# EAGLE design THC-schematic (EAGLE 6.4)
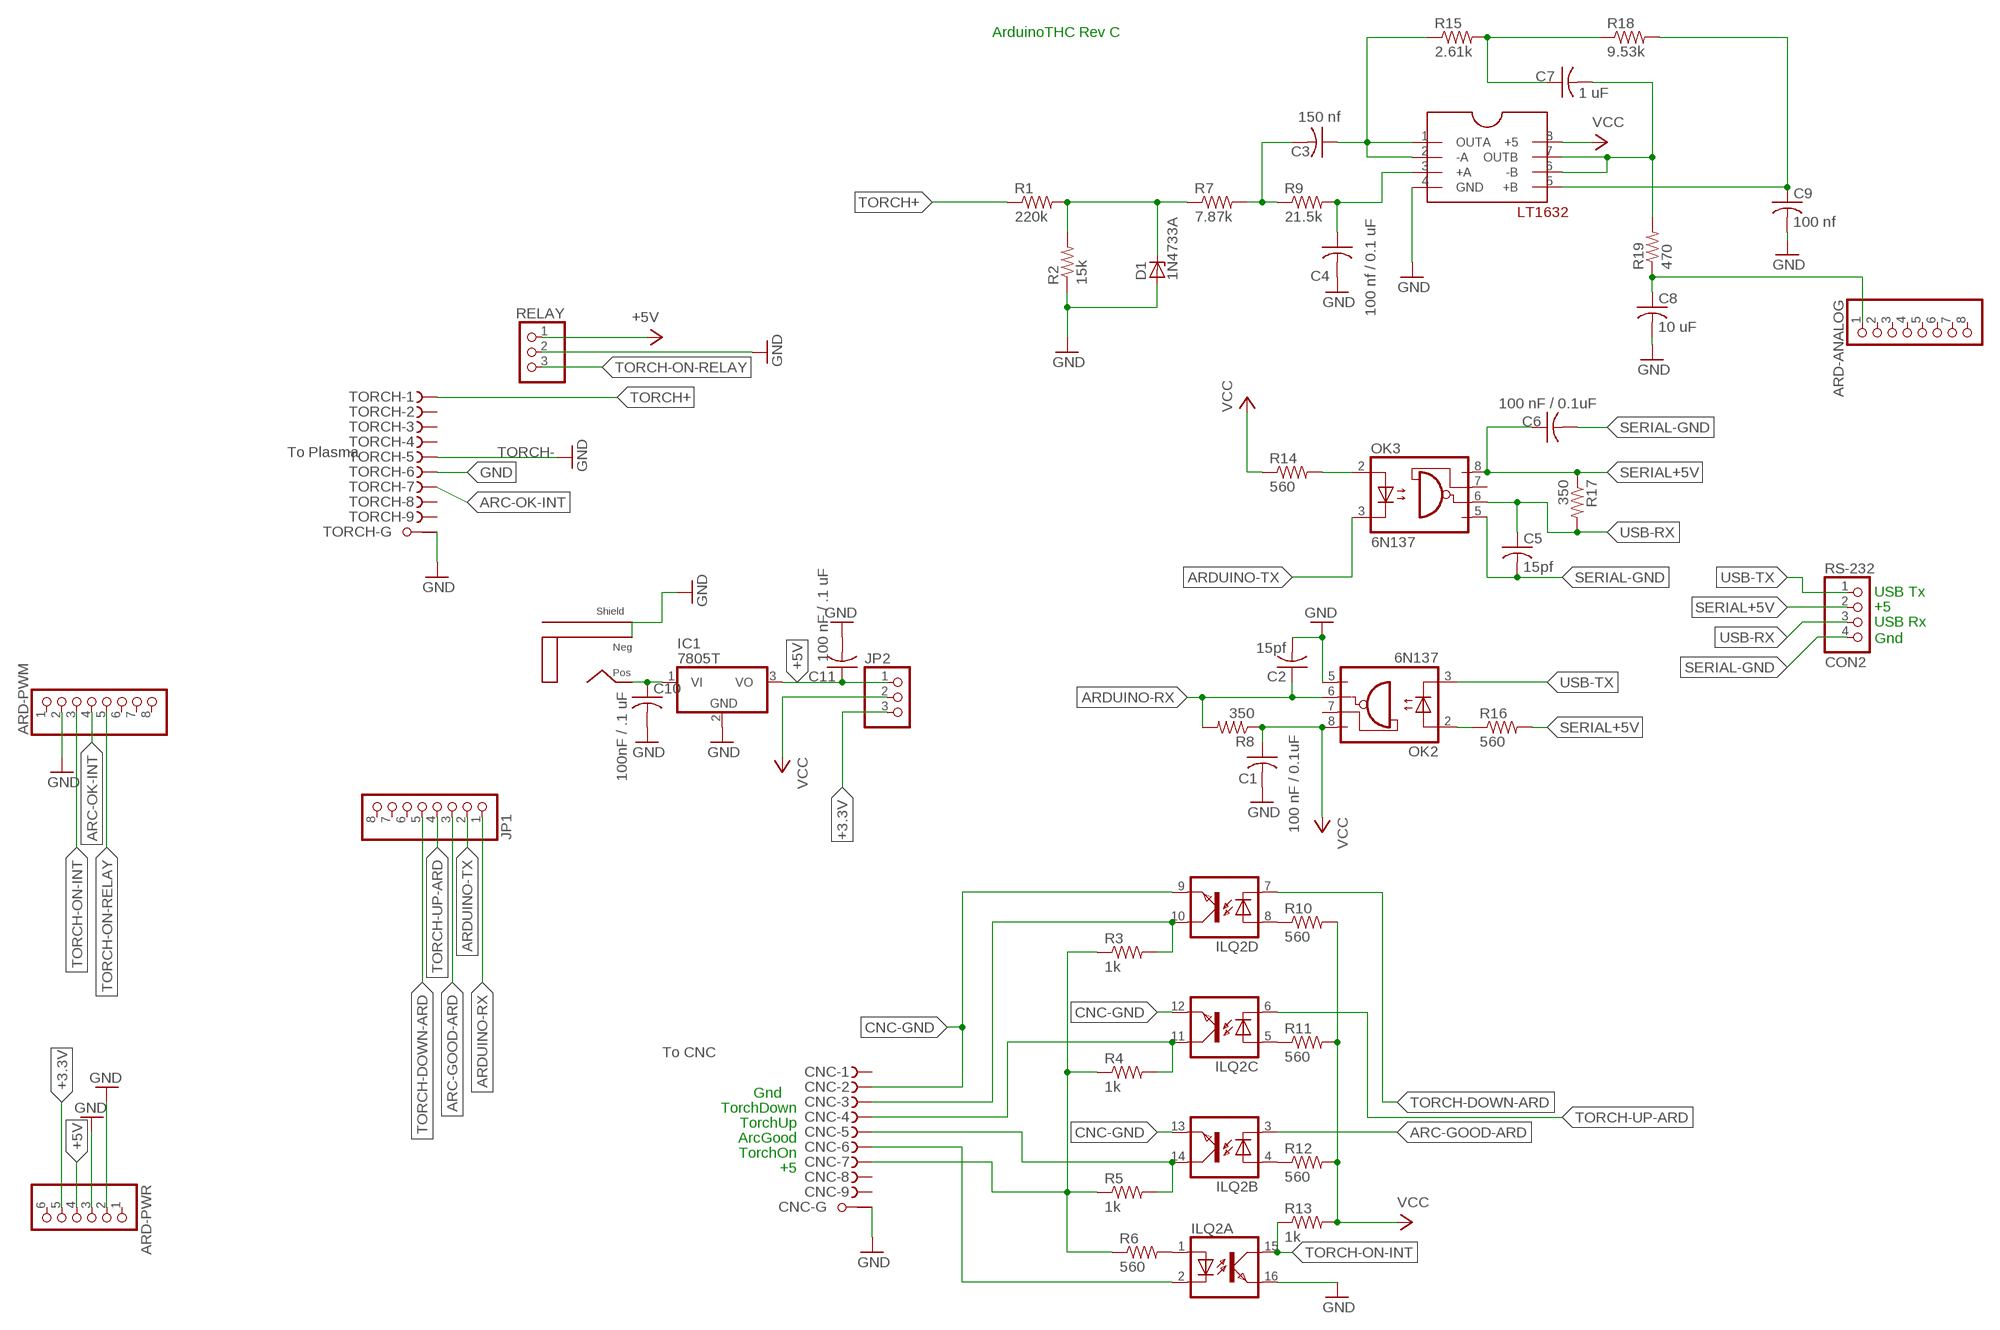
[diagram p0: schematic, sheet 1]

## Parts
ARD-ANALOG  PINHD-1X8  [1X08]
ARD-PWM  PINHD-1X8  [1X08]
ARD-PWR  PINHD-1X6  [1X06]
C1  100 nF / 0.1uF  C-US025-025X050  [C025-025X050]
C2  15pf  C-US025-025X050  [C025-025X050]
C3  150 nf  C-US025-025X050  [C025-025X050]
C4  100 nf / 0.1 uF  C-US025-025X050  [C025-025X050]
C5  15pf  C-US025-025X050  [C025-025X050]
C6  100 nF / 0.1uF  C-US025-025X050  [C025-025X050]
C7  1 uF  C-US025-025X050  [C025-025X050]
C8  10 uF  C-US025-025X050  [C025-025X050]
C9  100 nf  C-US025-025X050  [C025-025X050]
C10  100nF / .1 uF  C-US025-025X050  [C025-025X050]
C11  100 nF / .1 uF  C-US025-025X050  [C025-025X050]
CNC  F09HPS  [F09HP]
D1  1N4733A  ZPY  [DO41Z10]
IC1  7805T  [TO220H]
ILQ2  ILQ1  [DIL16]
J1  2.1MM-PLUG-PCB-MNT  [2.1MM-PLUG]
JP1  PINHD-1X8  [1X08]
JP2  PINHD-1X3  [1X03]
OK2  6N137  [DIL08]
OK3  6N137  [DIL08]
R1  220k  R-US_0207/7  [0207/7]
R2  15k  R-US_0207/7  [0207/7]
R3  1k  R-US_0207/7  [0207/7]
R4  1k  R-US_0207/7  [0207/7]
R5  1k  R-US_0207/7  [0207/7]
R6  560  R-US_0207/7  [0207/7]
R7  7.87k  R-US_0207/7  [0207/7]
R8  350  R-US_0207/7  [0207/7]
R9  21.5k  R-US_0207/7  [0207/7]
R10  560  R-US_0207/7  [0207/7]
R11  560  R-US_0207/7  [0207/7]
R12  560  R-US_0207/7  [0207/7]
R13  1k  R-US_0207/7  [0207/7]
R14  560  R-US_0207/7  [0207/7]
R15  2.61k  R-US_0207/7  [0207/7]
R16  560  R-US_0207/7  [0207/7]
R17  350  R-US_0207/7  [0207/7]
R18  9.53k  R-US_0207/7  [0207/7]
R19  470  R-US_0207/7  [0207/7]
RELAY  PINHD-1X3  [1X03]
RS-232  CON2  PINHD-1X4  [1X04]
TORCH  F09HPS  [F09HP]
U$1  LT1632  [DIP08]

## Nets
+3.3V: ARD-PWR.5 JP2.3
+5V: ARD-PWR.4 C11.1 IC1.3(VO) JP2.1 RELAY.1
ARC-GOOD-ARD: ILQ2.3(B:C) JP1.3
ARC-OK-INT: ARD-PWM.4 TORCH.7(-7:F)
ARD-ANALOG-IN: ARD-ANALOG.1 C8.1 R19.1
ARDUINO-RX: C2.1 JP1.1 OK2.6(VO) R8.2
ARDUINO-TX: JP1.2 OK3.3(C)
CNC-GND: CNC.2(-2:F) ILQ2.9(D:EMIT) ILQ2.12(C:EMIT) ILQ2.13(B:EMIT)
DIVIDER: D1.C R1.2 R2.2 R7.1
GND: ARD-PWM.2 ARD-PWR.2 ARD-PWR.3 C1.2 C2.2 C4.2 C8.2 C9.2 C10.2 C11.2 CNC.G1(-G:G1) D1.A IC1.2(GND) ILQ2.16(A:EMIT) J1.P$NEG J1.P$SHLD OK2.5(GND) R2.1 RELAY.2 TORCH.5(-5:F) TORCH.6(-6:F) TORCH.G1(-G:G1) U$1.4(GND)
N$1: C10.1 IC1.1(VI) J1.P$POS
N$2: ILQ2.4(B:A) R12.1
N$7: ILQ2.5(C:A) R11.1
N$8: ILQ2.8(D:A) R10.1
N$9: ILQ2.1(A:A) R6.2
N$10: CNC.5(-5:F) ILQ2.14(B:COL) R5.2
N$11: CNC.4(-4:F) ILQ2.11(C:COL) R4.2
N$12: CNC.3(-3:F) ILQ2.10(D:COL) R3.2
N$16: CNC.6(-6:F) ILQ2.2(A:C)
N$22: CNC.7(-7:F) R3.1 R4.1 R5.1 R6.1
N$26: C3.2 R7.2 R9.1
N$27: C4.1 R9.2 U$1.3(+A)
N$29: C3.1 R15.1 U$1.1(OUTA) U$1.2(-A)
N$30: C7.1 R15.2 R18.1
N$31: C9.1 R18.2 U$1.5(+B)
N$32: OK3.2(A) R14.2
N$34: OK2.2(A) R16.1
SERIAL+5V: C6.1 OK3.8(VCC) R16.2 R17.1 RS-232.2
SERIAL-GND: C5.2 C6.2 OK3.5(GND) RS-232.4
TORCH+: R1.1 TORCH.1(-1:F)
TORCH-DOWN-ARD: ILQ2.7(D:C) JP1.5
TORCH-ON-INT: ARD-PWM.3 ILQ2.15(A:COL) R13.1
TORCH-ON-RELAY: ARD-PWM.5 RELAY.3
TORCH-UP-ARD: ILQ2.6(C:C) JP1.4
UNFILTERED: C7.2 R19.2 U$1.6(-B) U$1.7(OUTB)
USB-RX: C5.1 OK3.6(VO) R17.2 RS-232.3
USB-TX: OK2.3(C) RS-232.1
VCC: C1.1 JP2.2 OK2.8(VCC) R8.1 R10.2 R11.2 R12.2 R13.2 R14.1 U$1.8(+5)
Unconnected: ARD-ANALOG.2 ARD-ANALOG.3 ARD-ANALOG.4 ARD-ANALOG.5 ARD-ANALOG.6 ARD-ANALOG.7 ARD-ANALOG.8 ARD-PWM.1 ARD-PWM.6 ARD-PWM.7 ARD-PWM.8 ARD-PWR.1 ARD-PWR.6 CNC.1(-1:F) CNC.8(-8:F) CNC.9(-9:F) CNC.G2(-G:G2) JP1.6 JP1.7 JP1.8 OK2.7(VE) OK3.7(VE) TORCH.2(-2:F) TORCH.3(-3:F) TORCH.4(-4:F) TORCH.8(-8:F) TORCH.9(-9:F) TORCH.G2(-G:G2)

## Notes on the sheet
- ArduinoTHC Rev C
- To Plasma | TORCH-
- USB Tx
- +5
- USB Rx
- Gnd
- To CNC
- Gnd
- TorchDown
- TorchUp
- ArcGood
- TorchOn
- +5

## Library data of the parts
ARD-ANALOG ARD-PWM JP1 = pinhead:PINHD-1X8: PIN HEADER
ARD-PWR = pinhead:PINHD-1X6: PIN HEADER
C1-C11 = resistor:C-US: CAPACITOR, American symbol
CNC TORCH = con-subd:F09HPS: SUB-D; OC_FARNELL: unknown; OC_NEWARK: unknown
D1 = diode:ZPY: Z DIODE 1 W
IC1 = adafruit:78*: Positive VOLTAGE REGULATOR Added bigger pads to the TO-92 package
ILQ2 = optocoupler:ILQ1: SIEMENS OPTO COUPLER; MF: VISHAY/TELEFUNKEN; MPN: ILQ1; OC_FARNELL: 1469501; OC_NEWARK: 88K1954
J1 = ArdunioPowerJack:2.1MM-PLUG-PCB-MNT
JP2 RELAY = pinhead:PINHD-1X3: PIN HEADER
OK2 OK3 = optocoupler:6N137: MOTOROLA OPTO COUPLER; MPN: 6N137; OC_FARNELL: 1328376; OC_NEWARK: 52M1895
R1-R19 = resistor:R-US_: RESISTOR, American symbol
RS-232 = pinhead:PINHD-1X4: PIN HEADER
U$1 = ArduinoThcOpAmp:LT1632

## Board
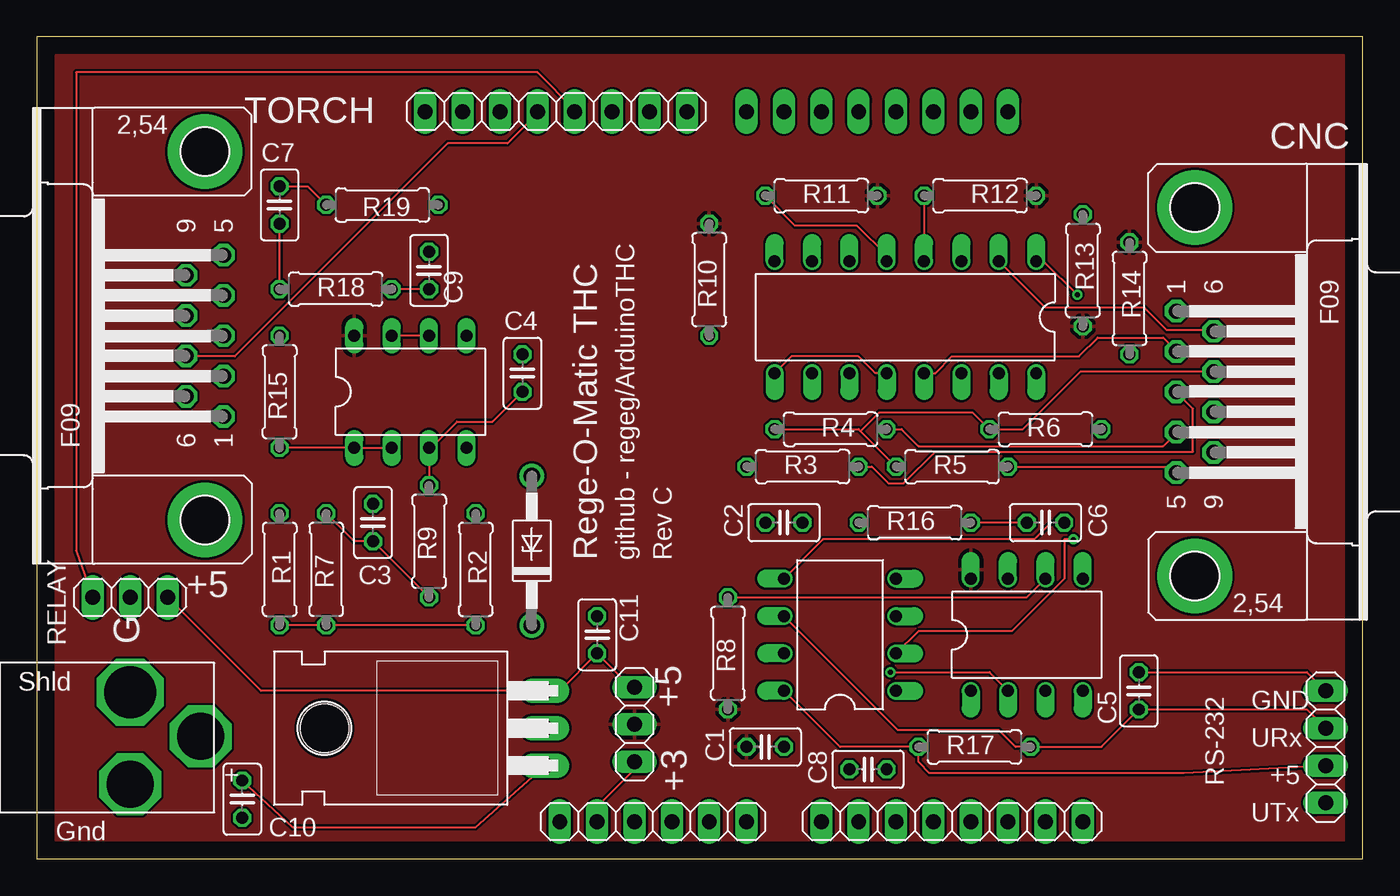
[diagram p1: board, top side]
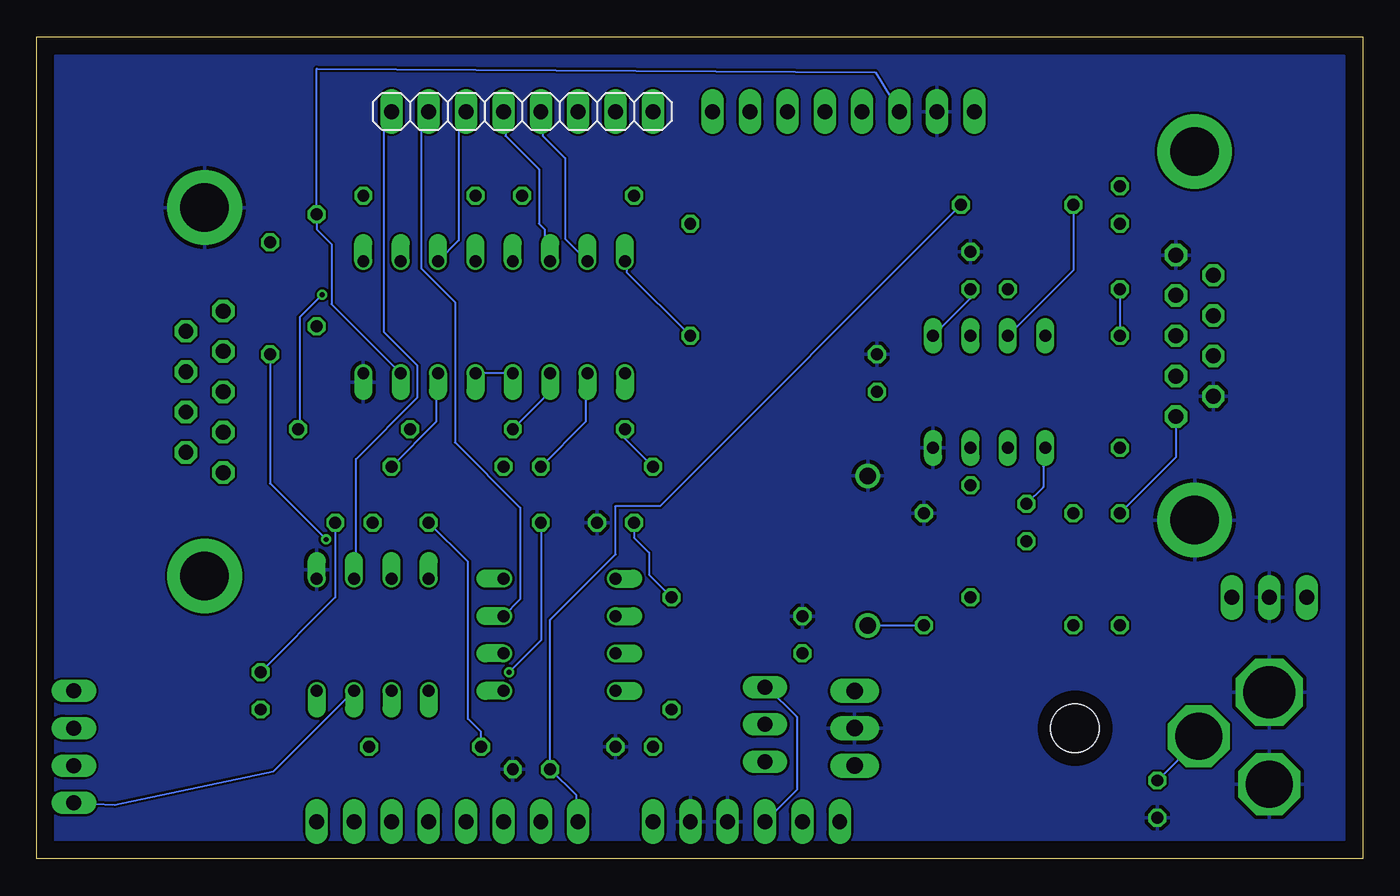
[diagram p2: board, bottom side, seen from below]

Size 90.15 x 55.88 mm. Coordinates in mm from the lower left corner, seen from the top.
Outline: 0,0 90.15,0 90.15,55.88 0,55.88 0,0
Copper layers (1*16): Top 0.0356mm / dielectric 1.5011mm / Bottom 0.0356mm
Design rules "LaenPCBOrder": minimum track width 6mil, minimum drill 13mil, track to track 6mil, track to pad 6mil, pad to pad 6mil, via to via 6mil, smd to smd 6mil, copper to edge 15mil, drill to drill 6mil, minimum pad ring 7mil, minimum via ring 7mil, stop-mask expansion 4mil, vias tented up to drill 0mil, thermal gap 10mil

### Footprints (pad centres in the part's own frame; a part is rotated, then mirrored left to right if it is on the bottom)
1X08 = drill 1.016 long: 1 -8.89,0; 2 -6.35,0; 3 -3.81,0; 4 -1.27,0; 5 1.27,0; 6 3.81,0; 7 6.35,0; 8 8.89,0
1X06 = drill 1.016 long: 1 -6.35,0; 2 -3.81,0; 3 -1.27,0; 4 1.27,0; 5 3.81,0; 6 6.35,0
C025-025X050 = drill 0.813 octagon: 1 -1.27,0; 2 1.27,0
F09HP = drill 1.016 octagon: 1 -5.486,-1.27; 2 -2.743,-1.27; 3 0,-1.27; 4 2.743,-1.27; 5 5.486,-1.27; 6 -4.115,1.27; 7 -1.372,1.27; 8 1.372,1.27; 9 4.115,1.27 | drill 3.302 pad 5.08: G1 -12.522,0; G2 12.522,0
DO41Z10 = drill 1.118: A 5.08,0; C -5.08,0
TO220H = drill 1.118 long: 1 -2.54,-10.16; 2 0,-10.16; 3 2.54,-10.16 | hole 3.302: 0,4.826
DIL16 = drill 0.813 offset: 1 -8.89,-3.81; 2 -6.35,-3.81; 3 -3.81,-3.81; 4 -1.27,-3.81; 5 1.27,-3.81; 6 3.81,-3.81; 7 6.35,-3.81; 8 8.89,-3.81; 9 8.89,3.81; 10 6.35,3.81; 11 3.81,3.81; 12 1.27,3.81; 13 -1.27,3.81; 14 -3.81,3.81; 15 -6.35,3.81; 16 -8.89,3.81
2.1MM-PLUG = drill 3.2 octagon: P$NEG 0,0; P$POS 4.801,3.251 | drill 3.556 octagon: P$SHLD 0,6.248
1X03 = drill 1.016 long: 1 -2.54,0; 2 0,0; 3 2.54,0
DIL08 = drill 0.813 offset: 1 -3.81,-3.81; 2 -1.27,-3.81; 3 1.27,-3.81; 4 3.81,-3.81; 5 3.81,3.81; 6 1.27,3.81; 7 -1.27,3.81; 8 -3.81,3.81
0207/7 = drill 0.813 octagon: 1 -3.81,0; 2 3.81,0
1X04 = drill 1.016 long: 1 -3.81,0; 2 -1.27,0; 3 1.27,0; 4 3.81,0
DIP08 = drill 0.813 long: 1 -2.54,-3.81; 2 0,-3.81; 3 2.54,-3.81; 4 5.08,-3.81; 5 5.08,3.81; 6 2.54,3.81; 7 0,3.81; 8 -2.54,3.81

### Placement (x,y rotation side)
ARD-ANALOG  62.23,2.54 0 top
ARD-PWM  35.31,50.8 0 top
ARD-PWR  41.91,2.54 180 top
C1  49.53,7.62 0 top
C2  50.8,22.86 0 top
C3  22.86,22.86 270 top
C4  33.02,33.02 90 top
C5  74.93,11.43 90 top
C6  68.58,22.86 0 top
C7  16.51,44.45 90 top
C8  56.52,6.1 0 top
C9  26.67,40.01 90 top
C10  13.97,4.06 270 top
C11  38.1,15.24 90 top
CNC  78.74,31.75 270 top
D1  33.66,20.95 90 top
IC1  24.38,8.89 90 top
ILQ2  59.05,36.83 180 top
J1  6.35,5.08 0 top
JP1  57.15,50.8 0 bottom
JP2  40.64,9.14 270 top
OK2  67.31,15.24 0 top
OK3  54.61,15.24 90 top
R1  16.51,19.68 270 top
R2  29.84,19.68 270 top
R3  52.07,26.67 0 top
R4  53.98,29.21 0 top
R5  62.23,26.67 0 top
R6  68.58,29.21 0 top
R7  19.68,19.68 90 top
R8  46.99,13.97 90 top
R9  26.67,21.59 90 top
R10  45.72,39.37 90 top
R11  53.34,45.09 0 top
R12  64.14,45.09 0 top
R13  71.12,40.01 270 top
R14  74.3,38.1 270 top
R15  16.51,31.75 90 top
R16  59.69,22.86 0 top
R17  63.75,7.62 0 top
R18  20.32,38.73 0 top
R19  23.5,44.45 180 top
RELAY  6.35,17.78 180 top
RS-232  87.63,7.62 90 top
TORCH  11.43,35.56 90 top
U$1  24.13,31.75 0 top

### Tracks (layer width: path | path; a pad name or v marks a point on that pad's centre or on a via)
+3.3V
  Top 0.152: ARD-PWR.5 38.1,3.94 38.48,3.94 40.64,6.1 JP2.3
+5V
  Top 0.152: JP2.1 40.39,11.68 C11.1 35.56,11.43 IC1.3 15.24,11.43 RELAY.1
  Bottom 0.152: ARD-PWR.4 38.48,4.7 38.48,9.65 40.51,11.68 JP2.1
ARC-GOOD-ARD
  Bottom 0.152: ILQ2.3 61.47,42.04 61.47,49.4 60.96,49.91 JP1.3
ARC-OK-INT
  Top 0.152: ARD-PWM.4 34.04,50.67 32,48.64 27.94,48.64 13.46,34.16 10.16,34.16 TORCH.7
ARD-ANALOG-IN
  Bottom 0.152: ARD-ANALOG.1 53.47,2.67 53.47,4.32 C8.1 55.24,16.26 50.8,20.7 50.8,24 47.75,24 R19.1
ARDUINO-RX
  Top 0.152: OK2.6 67.31,17.78 R8.2
  Bottom 0.152: R8.2 48.51,19.3 48.51,20.83 49.53,21.84 C2.1 | JP1.1 66.55,50.29 66.55,35.81 64.26,33.53 64.26,31.37 68.45,27.18 68.45,19.18 OK2.6
ARDUINO-TX
  Bottom 0.152: OK3.3 57.28,17.65 57.28,23.88 61.72,28.32 61.72,37.85 64.01,40.13 64.01,49.4 63.5,49.91 JP1.2
CNC-GND
  Top 0.152: ILQ2.9 51.31,34.16 55.88,34.16 57.02,33.02 ILQ2.12 | ILQ2.13 61.09,33.02 62.23,34.16 70.87,34.16 72.14,35.43 76.58,35.43 77.47,34.54 CNC.2
  Bottom 0.152: ILQ2.12 ILQ2.13
DIVIDER
  Top 0.152: R1.2 R7.1 R2.2
  Bottom 0.152: D1.C R2.2
GND
  pour Bottom: 1.27,54.61 1.27,1.27 88.9,1.27 88.9,54.61
N$1
  Top 0.152: IC1.1 29.84,2.16 17.4,2.16 C10.1
  Bottom 0.152: C10.1 11.18,8.13 11.18,8.26 J1.P$POS
N$2
  Top 0.152: R12.1 ILQ2.4
N$7
  Top 0.152: R11.1 51.56,43.05 55.75,43.05 57.78,41.02 ILQ2.5
N$8
  Bottom 0.152: R10.1 50.04,39.88 50.04,40.51 ILQ2.8
N$9  (via drill 0.33)
  Top 0.152: v70.74,38.35 68.45,40.64 ILQ2.1
  Bottom 0.152: R6.2 72.26,29.34 72.26,36.83 v70.74,38.35
N$10
  Top 0.152: R5.2 77.09,26.67 77.47,26.29 CNC.5
  Bottom 0.152: R5.2 62.99,29.72 62.99,32.89 ILQ2.14
N$11
  Top 0.152: R4.2 58.8,29.21 59.94,28.07 76.58,28.07 77.47,28.96 CNC.4
  Bottom 0.152: R4.2 55.24,31.75 ILQ2.11
N$12
  Top 0.152: CNC.3 78.61,30.61 78.61,27.69 61.09,27.69 58.93,25.53 57.91,25.53 56.77,26.67 R3.2
  Bottom 0.152: R3.2 52.83,29.72 52.83,32.89 ILQ2.10
N$16
  Top 0.152: ILQ2.2 68.58,37.47 75.31,37.47 76.83,35.94 80.01,35.94 CNC.6
N$22
  Top 0.152: 56.01,29.08 55.88,29.21 R4.1 | 56.01,29.08 R5.1 | 56.01,29.08 57.28,30.35 63.63,30.35 R6.1 67.06,29.21 70.99,33.15 80.01,33.15 CNC.7
  Bottom 0.152: R3.1 50.16,28.57 R4.1
N$26
  Top 0.152: R7.2 21.59,21.59 C3.2 R9.1
N$27
  Top 0.152: R9.2 U$1.3 26.8,27.94 28.57,29.72 30.99,29.72 C4.1
N$29
  Top 0.152: R15.1 U$1.1 U$1.2
  Bottom 0.152: C3.1 21.72,25.27 21.72,26.67 21.59,26.8 U$1.1
N$30
  Top 0.152: R18.1 C7.1
  Bottom 0.152: R18.1 R15.2
N$31
  Top 0.152: C9.1 R18.2
  Bottom 0.152: U$1.5 26.67,38.1 C9.1
N$32  (via drill 0.33)
  Top 0.152: OK3.2 59.94,15.49 66.29,15.49 69.85,19.05 69.85,21.72 v70.48,21.72
  Bottom 0.152: v70.48,21.72 74.3,25.53 R14.2
N$34  (via drill 0.33)
  Top 0.152: OK2.2 64.77,12.7 v58.04,12.7
  Bottom 0.152: v58.04,12.7 55.88,14.86 R16.1
SERIAL+5V
  Top 0.152: C6.1 R16.2 | OK3.8 54.61,7.62 R17.1 59.94,6.6 60.71,5.84 77.98,5.84 RS-232.2
  Bottom 0.152: R16.2 60.83,20.19 60.83,9.53 59.94,8.64 R17.1
SERIAL-GND
  Top 0.152: OK3.5 53.47,21.72 67.82,21.72 68.96,22.86 C6.2 | RS-232.4 86.36,12.7 C5.2
  Bottom 0.152: C5.2 69.85,17.78 C6.2
TORCH+
  Bottom 0.152: R1.1 12.7,27.3 TORCH.1
TORCH-DOWN-ARD
  Bottom 0.152: ILQ2.7 54.23,42.16 54.23,47.62 55.75,49.15 55.75,50.67 JP1.5
TORCH-ON-INT
  Bottom 0.152: ILQ2.15 70.1,37.72 70.1,41.78 71.12,42.8 R13.1 71.12,53.72 33.15,53.47 ARD-PWM.3
TORCH-ON-RELAY
  Top 0.152: RELAY.3 2.67,20.95 2.67,53.47 34.04,53.47 36.58,50.93 ARD-PWM.5
TORCH-UP-ARD
  Bottom 0.152: ILQ2.6 55.63,41.02 55.63,42.8 56.01,43.18 56.01,46.86 58.29,49.15 58.29,50.67 JP1.4
UNFILTERED
  Top 0.152: U$1.6 U$1.7 | R19.2 18.41,45.72 C7.2
  Bottom 0.152: U$1.7 19.68,40.01 R19.2
USB-RX
  Top 0.152: OK3.6 58.55,8.76 65.41,8.76 66.55,7.62 R17.2 72.39,7.62 C5.1 86.36,10.16 RS-232.3
USB-TX
  Bottom 0.152: OK2.3 74.04,5.97 84.84,3.68 RS-232.1
VCC
  pour Top: 1.27,54.61 1.27,1.27 88.9,1.27 88.9,54.61

### Text on the board
tPlace: Rege-O-Matic THC | github - regeg/ArduinoTHC | Rev C | +5 | G | +5 | GND | URx | +3 | +5 | UTx